# EasyEDA schematic ESP32-Transistor-Temperature-Controller.json
TITLE: ESP32 Transistor Temperature Controller; REV: 1.0; Date: 2026-09-03; Sheet: 1/1; Company: SMD VIBE
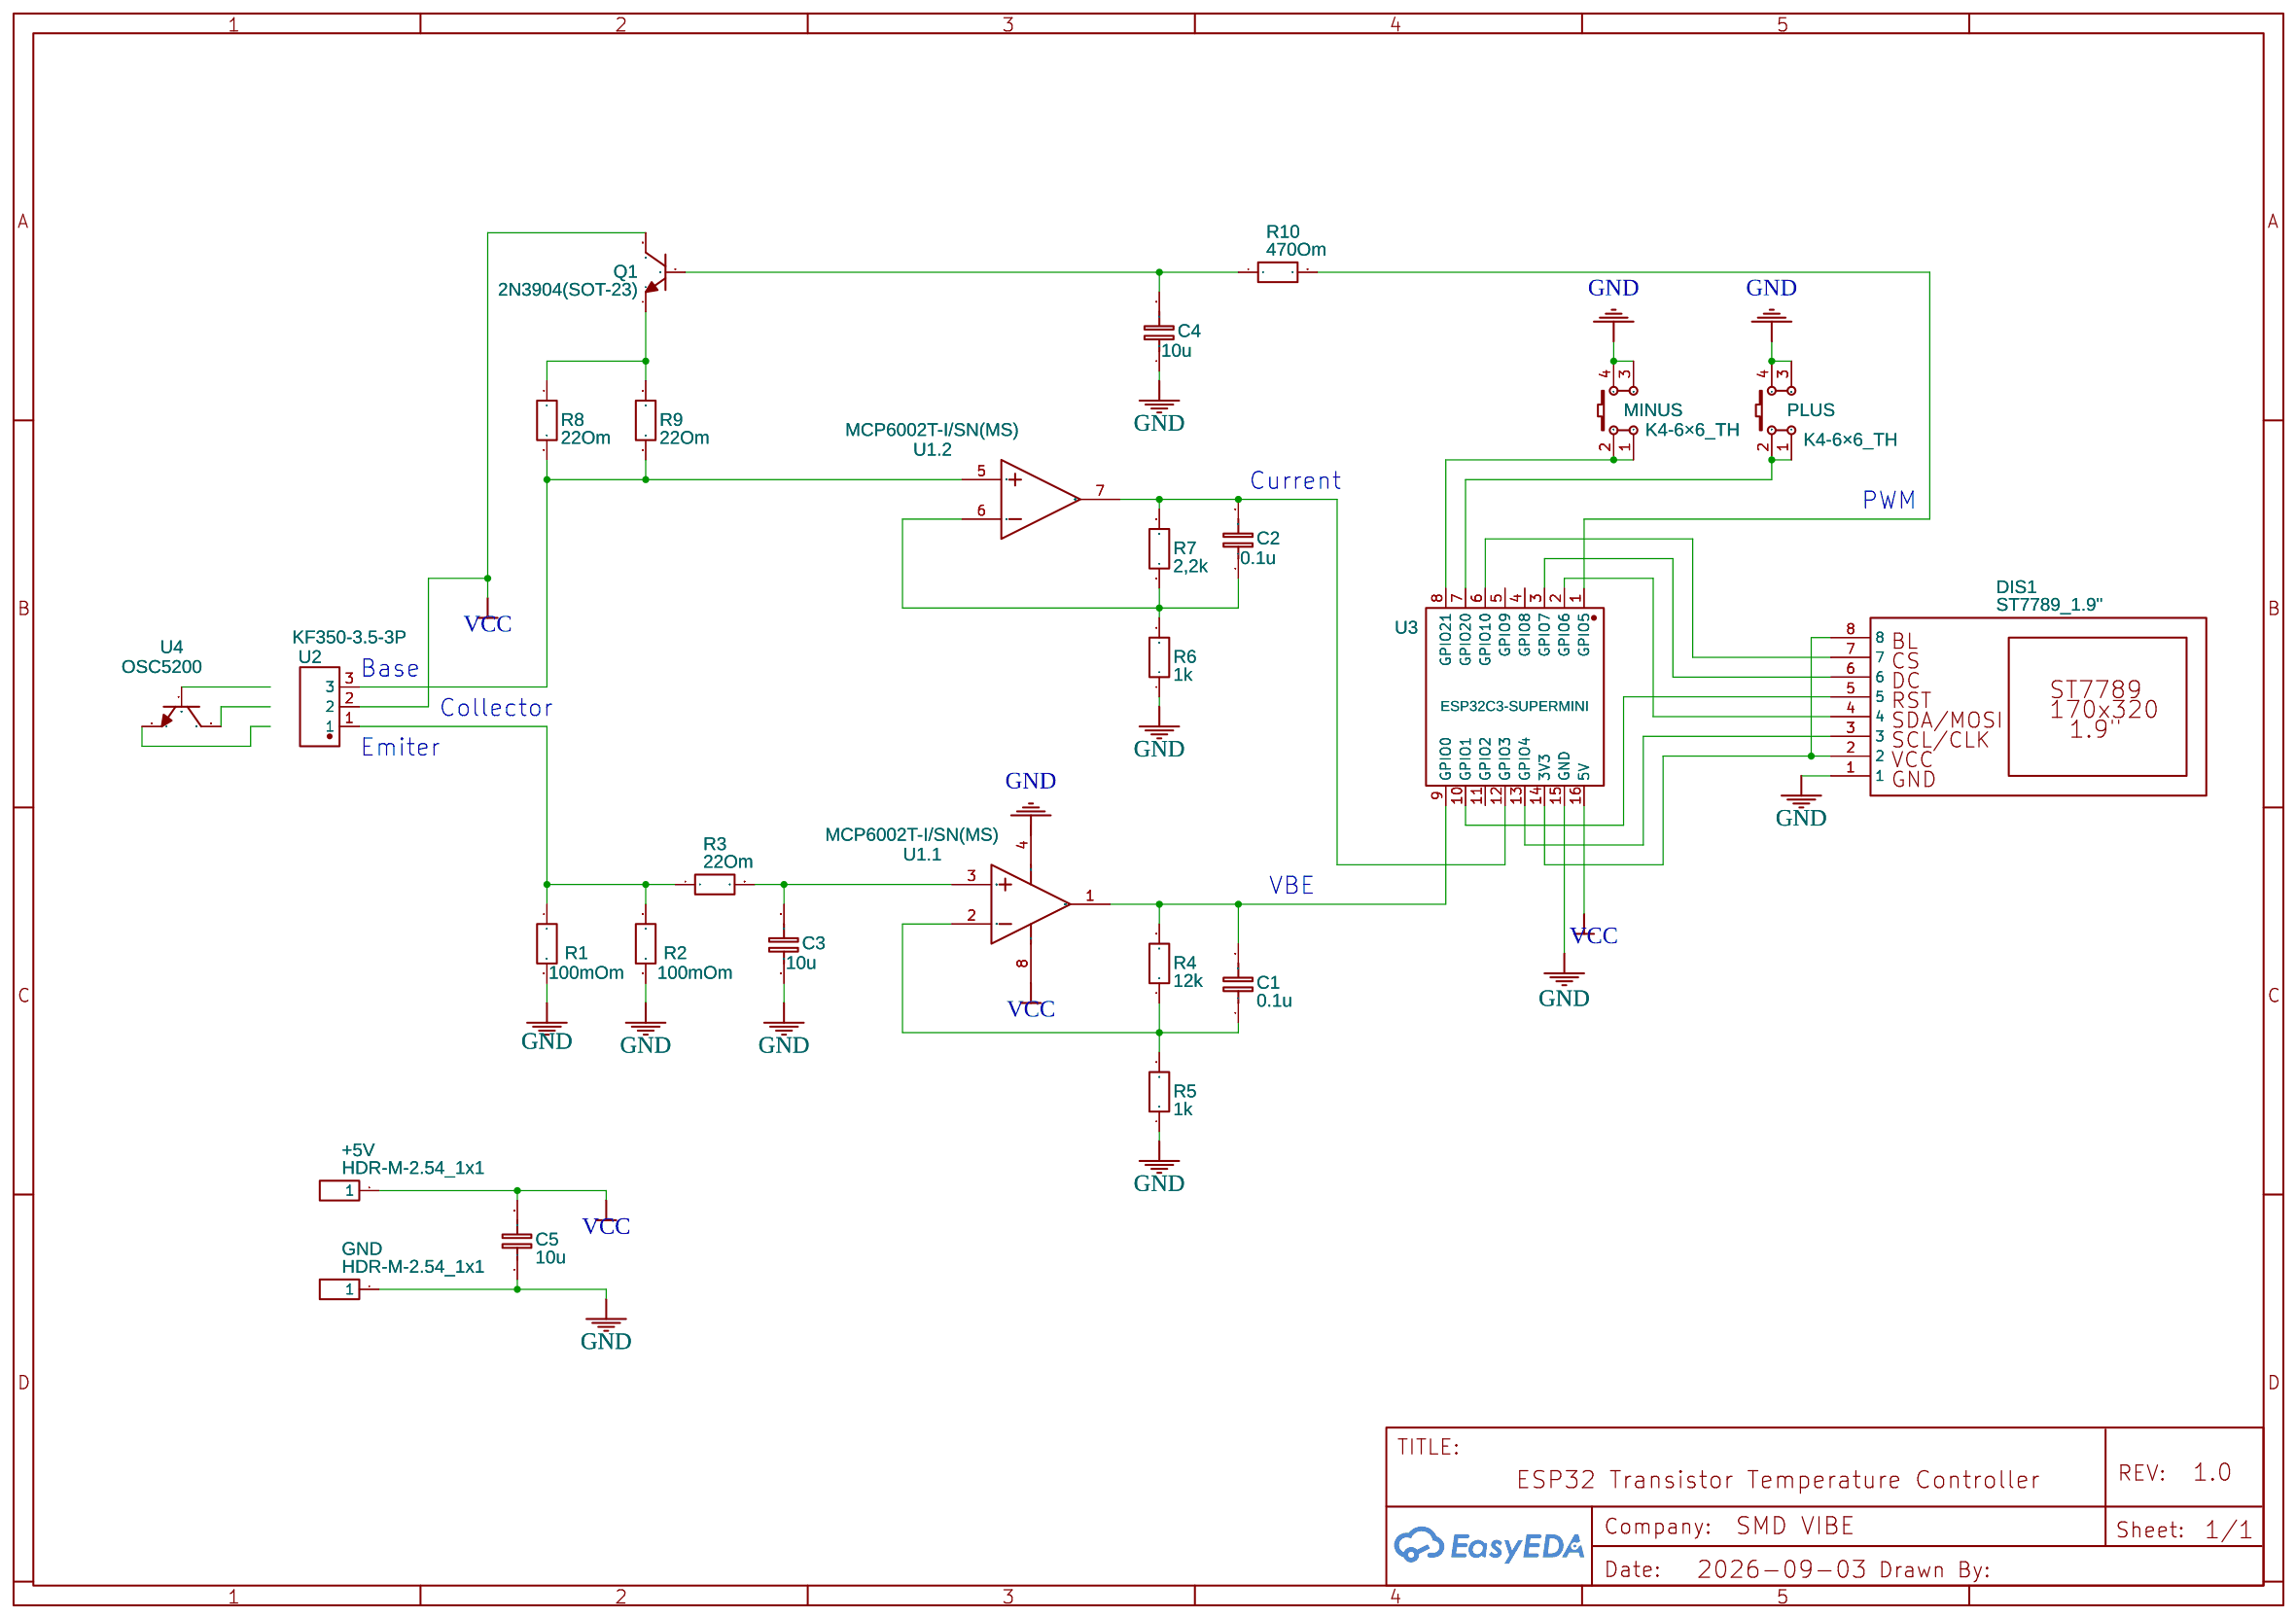
[diagram p0: schematic sheet]

## Parts
+5V  HDR-M-2.54_1x1  [HDR-M-2.54_1X1]
C1  0.1u  [C1206]
C2  0.1u  [C1206]
C3  10u  [C1206]
C4  10u  [C1206]
C5  10u  [C1206]
DIS1  ST7789_1.9"  [ST7789_1.9"_170X320]
GND  HDR-M-2.54_1x1  [HDR-M-2.54_1X1]
MINUS  K4-6×6_TH  [KEY-TH_4P-L6.0-W6.0-P4.50-LS6.5]
PLUS  K4-6×6_TH  [KEY-TH_4P-L6.0-W6.0-P4.50-LS6.5]
Q1  2N3904(SOT-23)  [SOT-23-3_L2.9-W1.3-P1.90-LS2.4-TR]
R1  100mOm  [R2512]
R2  100mOm  [R2512]
R3  22Om  [R1206]
R4  12k  [R1206]
R5  1k  [R1206]
R6  1k  [R1206]
R7  2,2k  [R1206]
R8  22Om  [R1206]
R9  22Om  [R1206]
R10  470Om  [R1206]
U1  MCP6002T-I/SN(MS)  [SOIC-8_L4.9-W3.9-P1.27-LS6.0-BL]  (sections 1,2)
U2  KF350-3.5-3P  [CONN-TH_3P-P3.50_KF350-3.5-3P]
U3  ESP32C3-SUPERMINI  [COMM-SMD_16P-L22.5-W18.0-P2.54-TL]
U4  OSC5200  [TO-3PL_L20.0-W5.0-P5.45-L]

## Library data of the parts
+5V GND = HDR-M-2.54_1x1: Supplier Part: C81276; Supplier: LCSC; Contributor: LCEDA_Lib
C1-C5 = C_1206_EU: Contributor: LCEDA_Lib
DIS1 = ST7789_1.9": Contributor: chemik0
MINUS PLUS = K4-6×6_TH: Supplier: LCSC; Supplier Part: C136684; Manufacturer: 韩国韩荣; Manufacturer Part: K2-1102DP-E4SW-04; Contributor: LCEDA_Lib
Q1 = 2N3904(SOT-23): Supplier: LCSC; Manufacturer: KEC; Manufacturer Part: 2n3904S-RTK/PS; Supplier Part: C18536; Paste Type: SOT-23; Contributor: LCEDA_Lib
R1 R2 = R_2512_EU: Contributor: LCEDA_Lib
R3-R10 = R_1206_EU: Contributor: LCEDA_Lib
U1 = MCP6002T-I/SN(MS): Supplier: LCSC; Supplier Part: C20538868; Manufacturer: MSKSEMI(美森科); JLCPCB Part Class: Extended Part; subpart_no: 1
U2 = KF350-3.5-3P: Contributor: LCSC; Supplier: LCSC; Supplier Part: C474893; Manufacturer: KEFA(科发); JLCPCB Part Class: Extended Part
U3 = ESP32C3-SUPERMINI: Supplier: LCSC; Supplier Part: C9900147397; Manufacturer: null; Manufacturer Part: ESP32C3-SuperMini; JLCPCB Part Class: Extended Part; Contributor: lcsc
U4 = OSC5200: Supplier: LCSC; Supplier Part: C20607870; Manufacturer: OSEN(欧芯); Contributor: lcsc

## Nets
GND: C3.1 C4.1 C5.1 DIS1.1 GND.1 MINUS.3 MINUS.4 PLUS.3 PLUS.4 R1.2 R2.2 R5.1 R6.1 U1.4(VSS) U3.15(GND)
VCC: +5V.1 C5.2 Q1.3(C) U1.8(VDD) U2.2 U3.16(5V)
Net-(C1-1): C1.1 R4.1 R5.2 U1.2(VINA-)
Net-(C1-2): C1.2 R4.2 U1.1(VOUTA) U3.9(GPIO0)
Net-(C2-1): C2.1 R6.2 R7.1 U1.6(VINB-)
Net-(C2-2): C2.2 R7.2 U1.7(VOUTB) U3.12(GPIO3)
Net-(C3-2): C3.2 R3.2 U1.3(VINA+)
Net-(C4-2): C4.2 Q1.2(B) R10.1
Net-(DIS1-2): DIS1.2 DIS1.8 U3.14(3V3)
Net-(DIS1-3): DIS1.3 U3.13(GPIO4)
Net-(DIS1-4): DIS1.4 U3.2(GPIO6)
Net-(DIS1-5): DIS1.5 U3.10(GPIO1)
Net-(DIS1-6): DIS1.6 U3.3(GPIO7)
Net-(DIS1-7): DIS1.7 U3.6(GPIO10)
Net-(MINUS-1): MINUS.1 MINUS.2 U3.8(GPIO21)
Net-(PLUS-1): PLUS.1 PLUS.2 U3.7(GPIO20)
Net-(Q1-1): Q1.1(E) R8.1 R9.1
Net-(R1-1): R1.1 R2.1 R3.1 U2.1
Net-(R8-2): R8.2 R9.2 U1.5(VINB+) U2.3
Net-(R10-2): R10.2 U3.1(GPIO5)

Not connected (* = marked no-connect by the designer): U3 4(GPIO8) 5(GPIO9) 11(GPIO2); U4 1(B) 2(C) 3(E)

## Notes on the sheet
- Current
- PWM
- Base
- Collector
- Emiter
- VBE
